# EAGLE schematic stopduino (EAGLE 5.11)
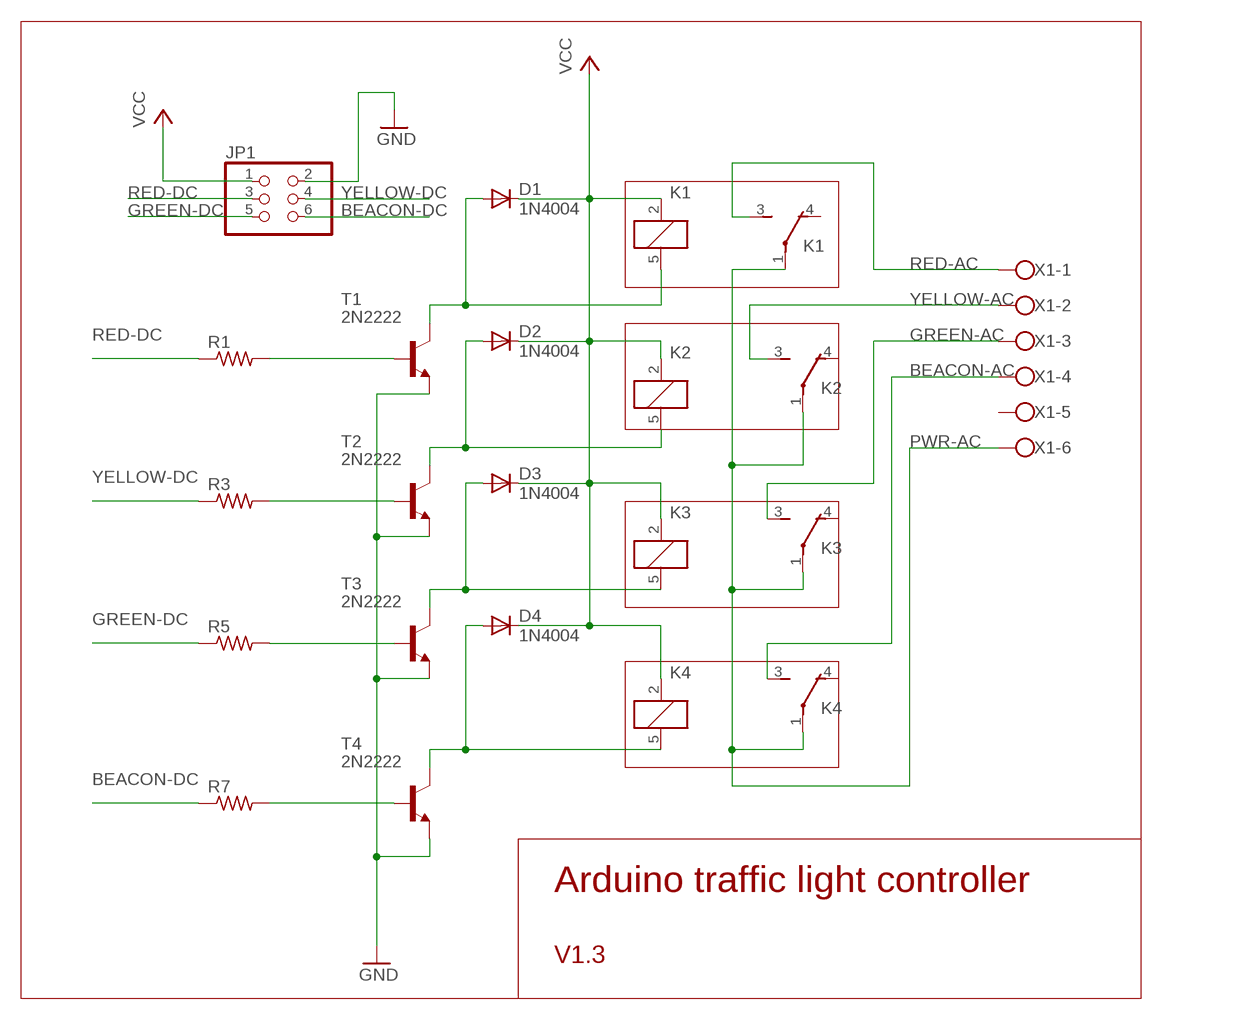
[diagram p0: schematic, sheet 1]

## Parts
D1  1N4004  [DO41-10]
D2  1N4004  [DO41-10]
D3  1N4004  [DO41-10]
D4  1N4004  [DO41-10]
JP1  PINHD-2X3  [2X03]
K1  AZ8-FORM-C  [AZ8]
K2  AZ8-FORM-C  [AZ8]
K3  AZ8-FORM-C  [AZ8]
K4  AZ8-FORM-C  [AZ8]
R1  R-US_0207/10  [0207/10]
R3  R-US_0207/10  [0207/10]
R5  R-US_0207/10  [0207/10]
R7  R-US_0207/10  [0207/10]
T1  2N2222  [TO92-EBC-OVAL]
T2  2N2222  [TO92-EBC-OVAL]
T3  2N2222  [TO92-EBC-OVAL]
T4  2N2222  [TO92-EBC-OVAL]
X1  W237-6  [W237-6]

## Nets
BEACON-AC [power]: K4.3(-1:S) X1.4
BEACON-DC: JP1.6 R7.1
GND: JP1.2 T1.E T2.E T3.E T4.E
GREEN-AC [power]: K3.3(-1:S) X1.3
GREEN-DC: JP1.5 R5.1
N$1: D4.A K4.5 T4.C
N$2: D3.A K3.5 T3.C
N$3: D2.A K2.5 T2.C
N$4: D1.A K1.5 T1.C
N$5: R5.2 T3.B
N$6: R1.2 T1.B
N$7: R3.2 T2.B
N$8: R7.2 T4.B
PWR-AC [power]: K1.1(-1:P) K2.1(-1:P) K3.1(-1:P) K4.1(-1:P) X1.6
RED-AC [power]: K1.3(-1:S) X1.1
RED-DC: JP1.3 R1.1
VCC: D1.C D2.C D3.C D4.C JP1.1 K1.2 K2.2 K3.2 K4.2
YELLOW-AC [power]: K2.3(-1:S) X1.2
YELLOW-DC: JP1.4 R3.1
Unconnected: K1.4(-1:O) K2.4(-1:O) K3.4(-1:O) K4.4(-1:O) X1.5

## Notes on the sheet
- Arduino traffic light controller
- V1.3

## Library data of the parts
D1-D4 = adafruit:1N4004: DIODE General purpose 1N400x type rectifier (With bigger pads) http://www.ladyada.net/library/pcb/eaglelibrary.html
JP1 = pinhead:PINHD-2X3: PIN HEADER
K1-K4 = relay:AZ8-FORM-C: MINIATURE PC BOARD RELAY Form C Source: www.azettler.com .. AZ8-1ch-12DSE.PDF; OC_FARNELL: unknown; OC_NEWARK: unknown
R1 R3 R5 R7 = adafruit:R-US_: RESISTOR, American symbol
T1-T4 = adafruit:2N2222: NPN TRANSISTOR Big oval pads
X1 = con-wago-500:W237-6: WAGO SCREW CLAMP; OC_FARNELL: unknown; OC_NEWARK: unknown

## Net classes
1 power: width 3 mm, clearance 0.9 mm